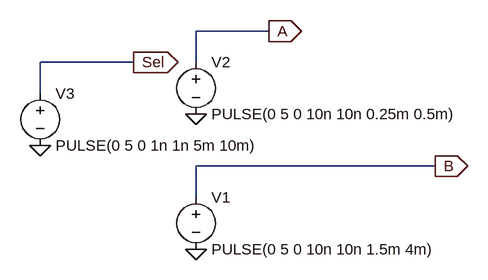
[diagram p0: schematic MUXinputs.asc]
MUXinputs.asc, the LTspice schematic file:
Version 4.1
SHEET 1 956 680
WIRE 304 -48 192 -48
WIRE 96 0 -48 0
WIRE 192 0 192 -48
WIRE -48 48 -48 0
WIRE 560 160 192 160
WIRE 192 208 192 160
FLAG -48 128 0
FLAG 192 80 0
FLAG 192 288 0
FLAG 96 0 Sel
IOPIN 96 0 Out
FLAG 304 -48 A
IOPIN 304 -48 Out
FLAG 560 160 B
IOPIN 560 160 Out
SYMBOL voltage 192 192 R0
WINDOW 123 0 0 Left 0
WINDOW 39 0 0 Left 0
SYMATTR InstName V1
SYMATTR Value PULSE(0 5 0 10n 10n 1.5m 4m)
SYMBOL voltage 192 -16 R0
WINDOW 123 0 0 Left 0
WINDOW 39 0 0 Left 0
SYMATTR InstName V2
SYMATTR Value PULSE(0 5 0 10n 10n 0.25m 0.5m)
SYMBOL voltage -48 32 R0
WINDOW 123 0 0 Left 0
WINDOW 39 0 0 Left 0
SYMATTR InstName V3
SYMATTR Value PULSE(0 5 0 1n 1n 5m 10m)

The netlist it stands for:
* MUXinputs.asc
V1 B 0 PULSE(0 5 0 10n 10n 1.5m 4m)
V2 A 0 PULSE(0 5 0 10n 10n 0.25m 0.5m)
V3 Sel 0 PULSE(0 5 0 1n 1n 5m 10m)
.backanno
.end